# EAGLE design dasblinkenhat-controller-mk-4.1 (EAGLE 7.5.0)
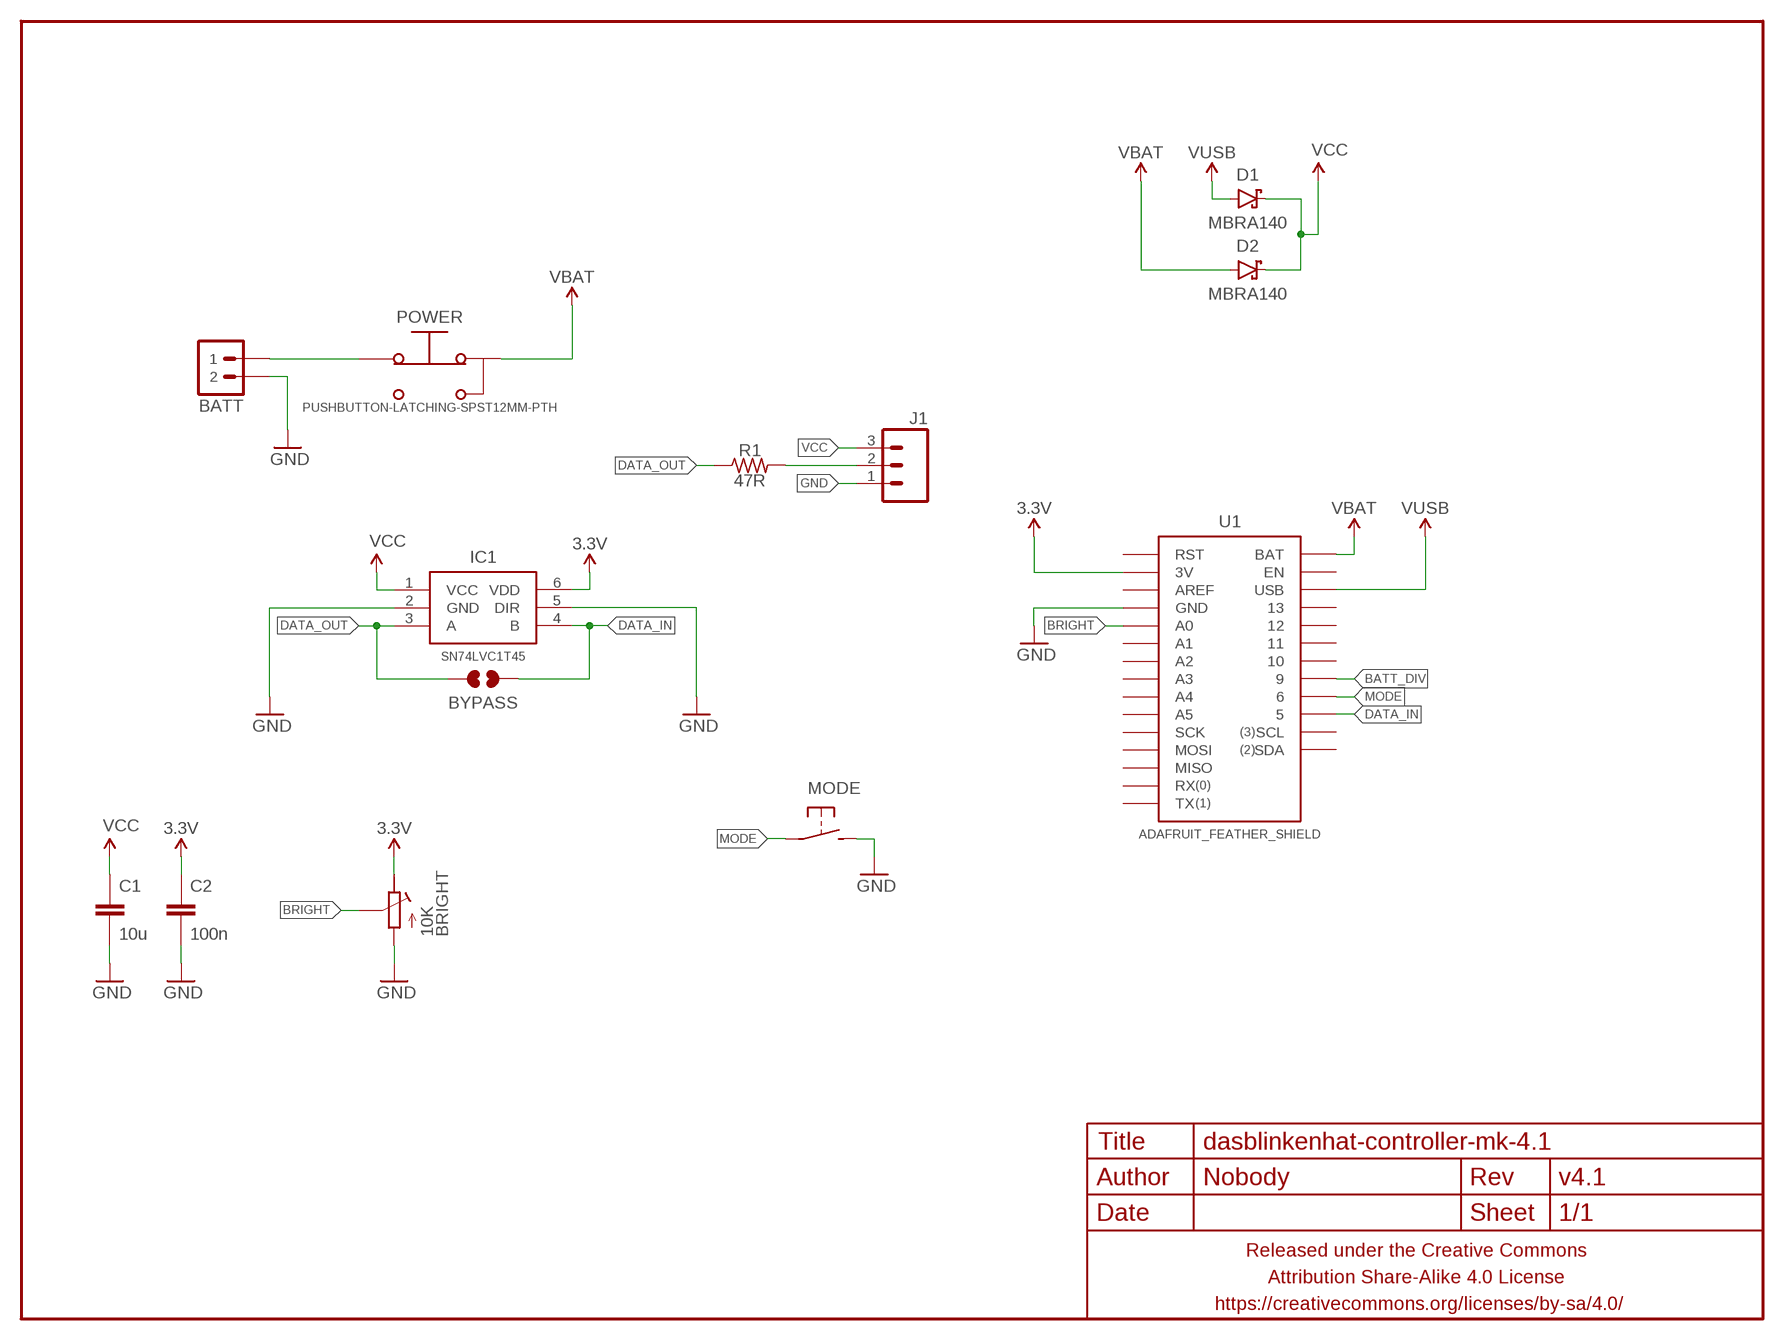
[diagram p0: schematic, sheet 1]

## Parts
BATT  M02JST-2MM-SMT  [JST-2-SMD]
BRIGHT  10K  POTENTIOMETEREVM3Y  [EVM3Y]
BYPASS  JUMPER-PAD-2-NOYES_SILK  [PAD-JUMPER-2-NO_YES_SILK]
C1  10u  CAPACITOR-CERAMICC0805  [C0805]
C2  100n  CAPACITOR-CERAMICC0603  [C0603]
D1  MBRA140  DIODE-SCHOTTKYMBRA140  [SMA-DIODE]
D2  MBRA140  DIODE-SCHOTTKYMBRA140  [SMA-DIODE]
FRAME1  FRAME-LETTERNO_PACKAGE  [DUMMY]
IC1  SN74LVC1T45  SN74LVC1T45SOT23-6  [SOT23-6]
J1  M03JST-XH-RA-PTH  [JST-3-XH-RA-PTH]
MODE  DTS-6MM  SPST-NO-TACT12MM-PTH  [TACTILE-PTH-12MM]
POWER  PUSHBUTTON-LATCHING-SPST12MM-PTH  [PUSHBUTTON-CW-SPST-12MM]
R1  47R  RESISTORR0603  [R0603]
U1  ADAFRUIT_FEATHER_SHIELD  [ADAFRUIT_FEATHER]

## Nets
3.3V: BRIGHT.E C2.1 IC1.6(VDD) U1.3V
BATT_DIV: U1.9
BRIGHT: BRIGHT.S U1.A0
DATA_IN: BYPASS.1 IC1.4(B) U1.5
DATA_OUT: BYPASS.2 IC1.3(A) R1.1
GND: BATT.1 BRIGHT.A C1.2 C2.2 IC1.2(GND) IC1.5(DIR) J1.1 MODE.3 MODE.4 U1.GND@0(GND) U1.GND@1(GND)
MODE: MODE.1 MODE.2 U1.6
N$1: BATT.2 POWER.2(NC)
N$2: J1.2 R1.2
VBAT: D2.A POWER.1(COM) U1.BAT
VCC: C1.1 D1.C D2.C IC1.1(VCC) J1.3
VUSB: D1.A U1.USB
Unconnected: U1.10 U1.11 U1.12 U1.13 U1.A1 U1.A2 U1.A3 U1.A4 U1.A5 U1.AREF U1.EN U1.MISO U1.MOSI U1.RST U1.RX U1.SCK U1.SCL U1.SDA U1.TX

## Library data of the parts
BATT = a_parts:M02: Standard 2-pin 0.1" header. Use with - straight break away headers ( PRT-00116) - right angle break away headers (PRT-00553) - swiss pins (PRT-00743) - machine pins (PRT-00117) - female headers (PRT-00115) Molex polarized connector foot print use with: PRT-08233 with associated crimp pins and housings. 2.54_SCREWTERM for use with PRT-10571. 3.5mm Screw Terminal footprints for PRT-08084 5mm Screw Terminal footprints for use with PRT-08433; PROD_ID: CONN-08352
BRIGHT = a_parts:POTENTIOMETER: Trimm resistor
BYPASS = a_parts:JUMPER-PAD-2-NO
C1 C2 = a_parts:CAPACITOR-CERAMIC: CAPACITOR, European symbol
D1 D2 = a_parts:DIODE-SCHOTTKY: Schottky diodes in SFE's production catalog BAT20J 1A 23V 0.62Vf RB751 120mA 40V 0.37Vf PMEG4005EJ 0.5A 40V 0.42Vf MBRA140 1A 40V 0.5Vf B340A 3A 40V SMA; PROD_ID: DIO-08053
FRAME1 = a_parts:FRAME-LETTER: Schematic Frame Standard 8.5x11 US Letter frame; DESIGNER: Nobody; VERSION: v4.1
IC1 = a_parts:SN74LVC1T45
J1 = a_parts:M03: Header 3 Standard 3-pin 0.1" header. Use with straight break away headers (SKU : PRT-00116), right angle break away headers (PRT-00553), swiss pins (PRT-00743), machine pins (PRT-00117), and female headers (PRT-00115). Molex polarized connector foot print use with SKU : PRT-08232 with associated crimp pins and housings.
MODE = A_butts:SPST-NO-TACT
POWER = a_parts:PUSHBUTTON-LATCHING-SPST
R1 = a_parts:RESISTOR: RESISTOR, American symbol
U1 = a_parts:ADAFRUIT_FEATHER_SHIELD

## Board
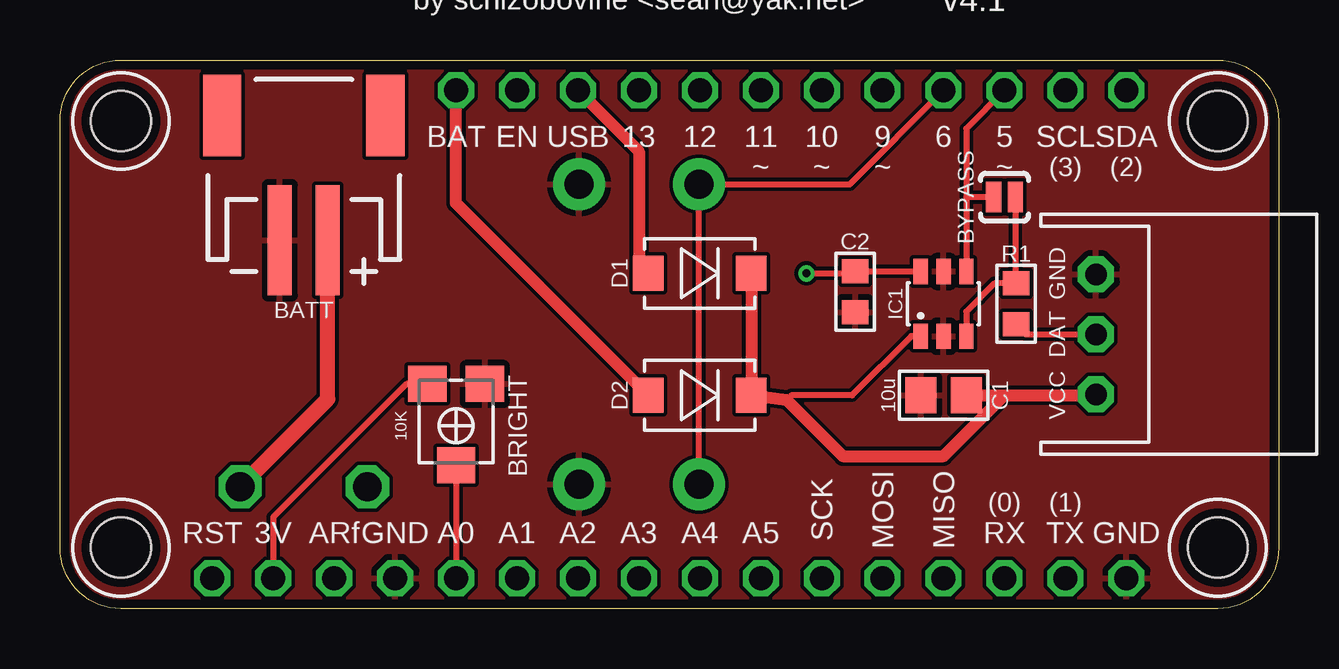
[diagram p1: board, top side]
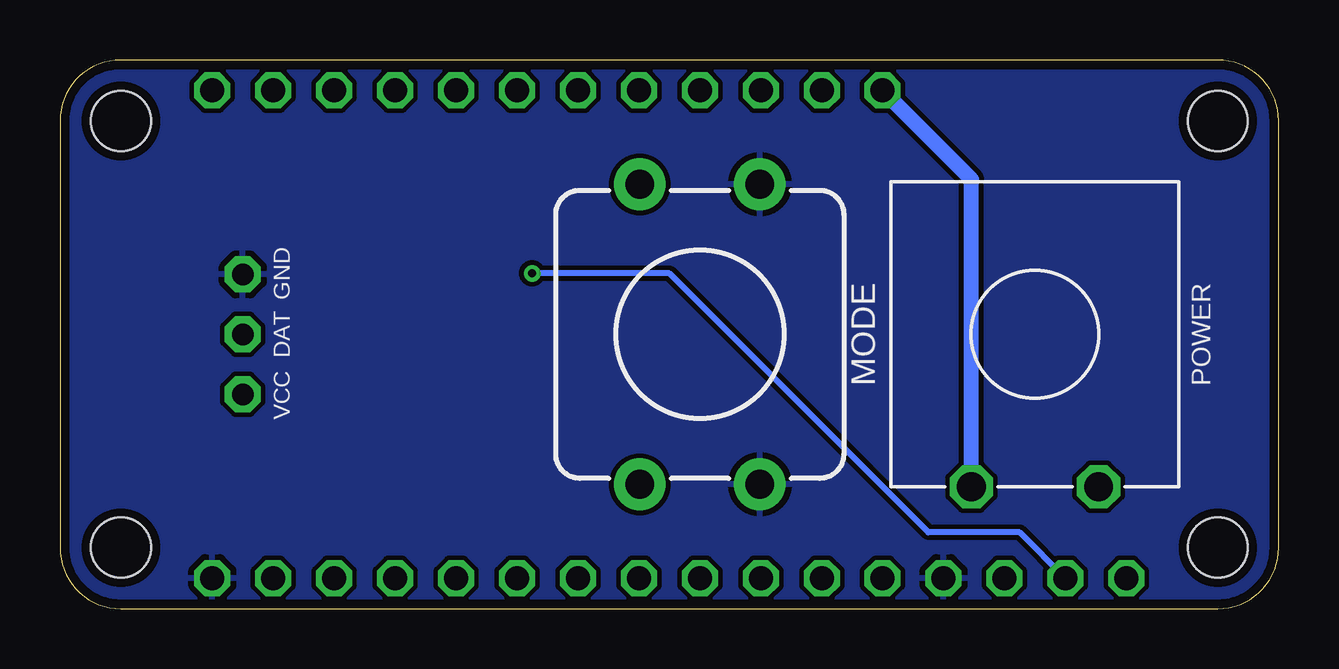
[diagram p2: board, bottom side, seen from below]

Size 50.8 x 22.86 mm. Coordinates in mm from the lower left corner, seen from the top.
Outline: 48.26,0 2.54,0 arc-90 0,2.54 0,20.32 arc-90 2.54,22.86 48.26,22.86 arc-90 50.8,20.32 50.8,2.54 arc-90 48.26,0
Copper layers (1*16): Top 0.0356mm / dielectric 1.5011mm / Bottom 0.0356mm
Design rules "LaenPCBOrder2": minimum track width 6mil, minimum drill 13mil, track to track 6mil, track to pad 6mil, pad to pad 6mil, via to via 6mil, smd to smd 6mil, copper to edge 15mil, drill to drill 6mil, minimum pad ring 7mil, minimum via ring 7mil, stop-mask expansion 3mil, vias tented up to drill 20mil, thermal gap 10mil
Holes 2.5 mm at 2.54,20.32 2.54,2.54 48.26,2.54 48.26,20.32

### Footprints (pad centres in the part's own frame; a part is rotated, then mirrored left to right if it is on the bottom)
JST-2-SMD = smd 1 x 4.6: 1 -1,-3.7; 2 1,-3.7 | smd 1.6 x 3.4: NC1 -3.4,1.5; NC2 3.4,1.5
EVM3Y = smd 1.6 x 1.5: A -1.2,-1.75; E 1.2,-1.75; S 0,1.65
PAD-JUMPER-2-NO_YES_SILK = smd 0.635 x 1.27: 1 -0.45,0; 2 0.45,0
C0805 = smd 1.3 x 1.5: 1 -0.95,0; 2 0.95,0
C0603 = smd 1 x 1.1: 1 -0.85,0; 2 0.85,0
SMA-DIODE = smd 1.27 x 1.47: A -2.15,0; C 2.15,0
SOT23-6 = smd 0.6 x 1.05: 1 -0.95,-1.35; 2 0,-1.35; 3 0.95,-1.35; 4 0.95,1.35; 5 0,1.35; 6 -0.95,1.35
JST-3-XH-RA-PTH = drill 0.9 pad 1.5 octagon: 1 -2.5,0; 2 0,0; 3 2.5,0
TACTILE-PTH-12MM = drill 1.2 pad 2.159: 1 6.25,-2.5; 2 -6.25,-2.5; 3 6.25,2.5; 4 -6.25,2.5
PUSHBUTTON-CW-SPST-12MM = drill 1.2 octagon: 1 6.35,-2.65; 2 6.35,2.65
R0603 = smd 1 x 1.1: 1 -0.85,0; 2 0.85,0
ADAFRUIT_FEATHER = drill 1 pad 1.5 octagon: 3V -16.51,-10.16; 5 13.97,10.16; 6 11.43,10.16; 9 8.89,10.16; 10 6.35,10.16; 11 3.81,10.16; 12 1.27,10.16; 13 -1.27,10.16; A0 -8.89,-10.16; A1 -6.35,-10.16; A2 -3.81,-10.16; A3 -1.27,-10.16; A4 1.27,-10.16; A5 3.81,-10.16; AREF -13.97,-10.16; BAT -8.89,10.16; EN -6.35,10.16; GND@0 -11.43,-10.16; GND@1 19.05,-10.16; MISO 11.43,-10.16; MOSI 8.89,-10.16; RST -19.05,-10.16; RX 13.97,-10.16; SCK 6.35,-10.16; SCL 16.51,10.16; SDA 19.05,10.16; TX 16.51,-10.16; USB -3.81,10.16

### Placement (x,y rotation side)
BATT  10.16,19.05 0 top
BRIGHT  16.51,7.62 180 top
BYPASS  39.37,17.14 0 top
C1  36.83,8.89 180 top
C2  33.15,13.21 270 top
D1  26.67,13.97 0 top
D2  26.67,8.89 0 top
FRAME1  0,0 0 top
IC1  36.83,12.7 0 top
J1  43.18,11.43 270 top
MODE  24.13,11.43 270 bottom
POWER  10.16,11.43 270 bottom
R1  39.85,12.7 270 top
U1  25.4,11.43 0 top
U$2  [OSHWLOGO_TINY_SILKONLY]  12.7,27.94 0 bottom  (outside the outline)

### Tracks (layer width: path | path; a pad name or v marks a point on that pad's centre or on a via)
3.3V  (via drill 0.33)
  Top 0.254: v31.11,13.97 33.06,13.97 C2.1 IC1.6 | BRIGHT.E 14.45,9.37 8.89,3.81 U1.3V
  Bottom 0.254: U1.3V 10.79,3.17 14.61,3.17 25.4,13.97 v31.11,13.97
BRIGHT
  Top 0.254: BRIGHT.S U1.A0
DATA_IN
  Top 0.254: U1.5 37.78,20 37.78,17.14 | 37.78,17.14 IC1.4 | BYPASS.1 37.78,17.14
DATA_OUT
  Top 0.254: BYPASS.2 39.82,13.58 R1.1 38.95,13.55 37.78,12.38 IC1.3
GND
  pour Top: 48.26,0 2.54,0 arc-90 0,2.54 0,20.32 arc-90 2.54,22.86 48.26,22.86 arc-90 50.8,20.32 50.8,2.54 arc-90
  pour Bottom (isolate 0.2): 48.26,0 2.54,0 arc-90 0,2.54 0,20.32 arc-90 2.54,22.86 48.26,22.86 arc-90 50.8,20.32 50.8,2.54 arc-90
MODE
  Top 0.254: MODE.1 MODE.2 32.92,17.68 U1.6
N$1
  Top 0.635: POWER.2 11.16,8.73 BATT.2
N$2
  Top 0.254: R1.2 40.27,11.43 J1.2
VBAT
  Top 0.508: D2.A 16.51,16.9 U1.BAT
  Bottom 0.635: POWER.1 12.81,17.89 U1.BAT
VCC
  Top 0.254: IC1.1 35.48,11.35 33.02,8.89 30.48,8.89 30.29,8.7
  Top 0.508: D1.C D2.C 30.29,8.7 32.63,6.35 36.83,6.35 39.37,8.89 | 39.37,8.89 43.14,8.89 J1.3 | C1.1 39.37,8.89
VUSB
  Top 0.508: U1.USB 24.13,19.05 24.13,14.36 D1.A

### Text on the board
tPlace: GND | DAT | VCC
bPlace: GND | DAT | VCC